# Altium schematic sheet POWER.SchDoc
size A4
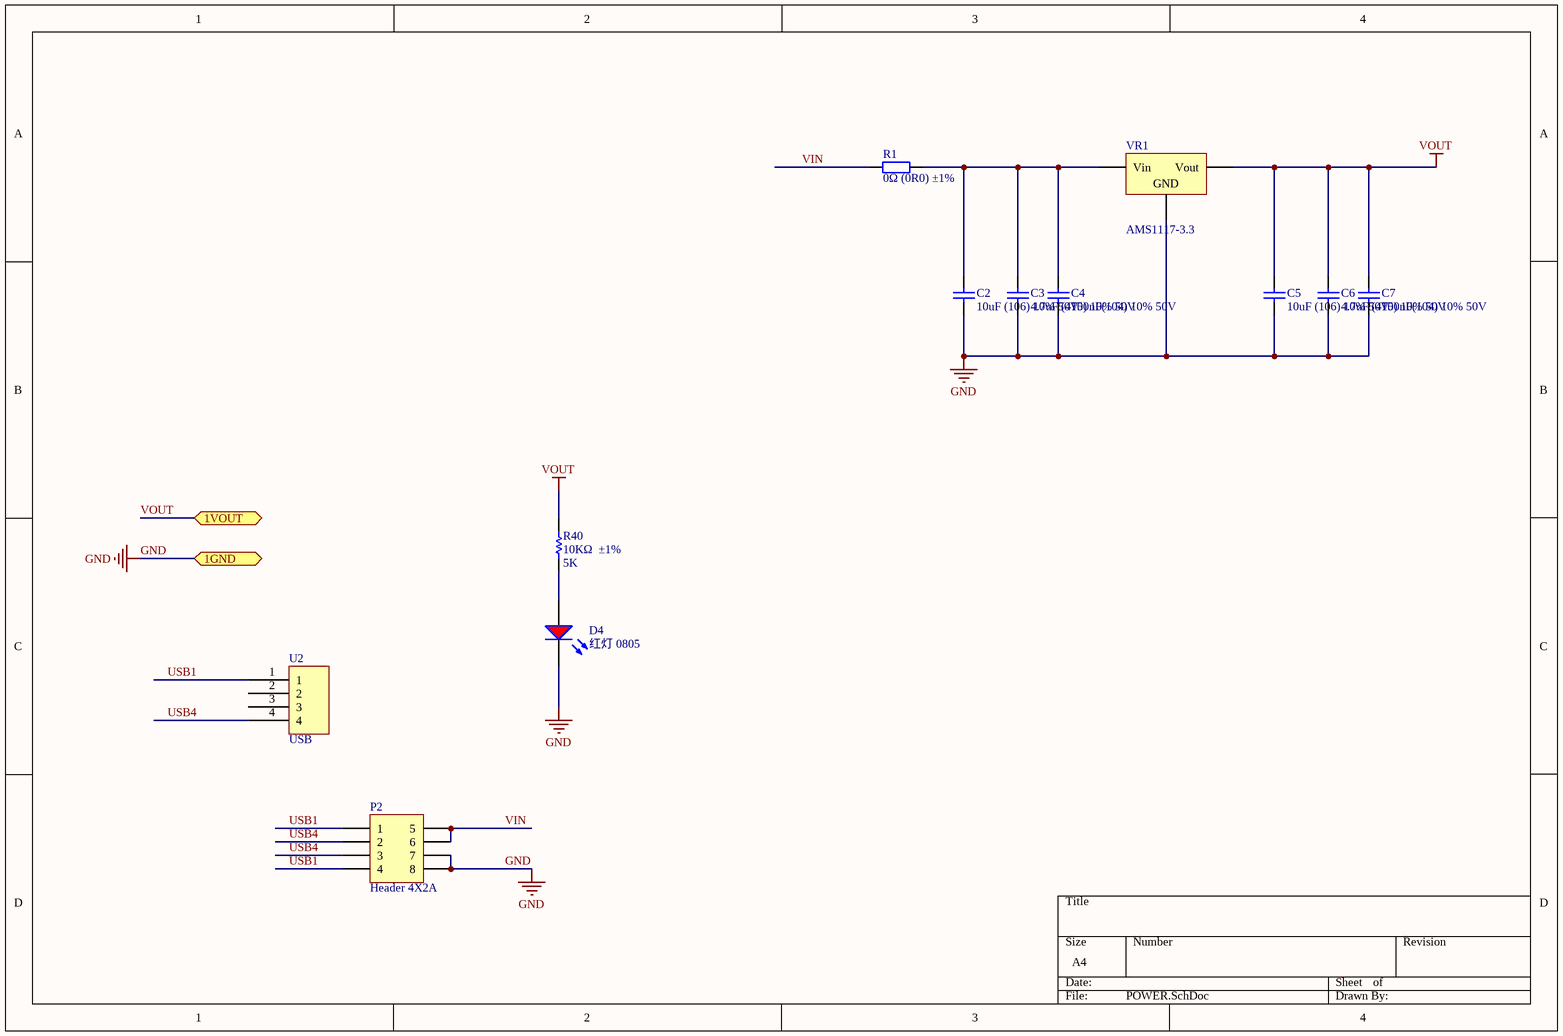
[diagram p0: POWER.SchDoc]

## Parts
C2  10uF (106) 10% 50V  [1206_C]
C3  4.7uF (475) 10% 50V  [1206_C]
C4  100nF(104) 10% 50V  [0805_C]
C5  10uF (106) 10% 50V  [1206_C]
C6  4.7uF (475) 10% 50V  [1206_C]
C7  100nF(104) 10% 50V  [0805_C]
D4  红灯 0805  [0805_LED_S1]
P2  Header 4X2A  [HDR2X4_CEN]
R1  0Ω (0R0) ±1%  [1206_R]
R40  10KΩ  ±1%  value 5K  [0805_R]
U2  USB  [USB_PORT]
VR1  AMS1117-3.3  [SOT-223]

## Ports
1GND, 1VOUT

## Nets
GND: C2.1 C3.1 C4.1 C5.1 C6.1 C7.1 D4.K P2.7 P2.8 VR1.1(GND) ; port 1GND
VOUT: C5.2 C6.2 C7.2 R40.2 VR1.2(Vout) ; port 1VOUT
USB1: P2.1 P2.4 U2.1
USB4: P2.2 P2.3 U2.4
VIN: P2.5 P2.6 R1.1
NetC2_2: C2.2 C3.2 C4.2 R1.2 VR1.3(Vin)
NetD4_A: D4.A R40.1

Not connected (* = marked no-connect by the designer): U2 2 3

## Library data of the parts
C2 C5 = 1206 10uF (106) 10% 50V: 贴片电容; ComponentLink1Description: 供应商链接; ComponentLink1URL: http://www.szlcsc.com/product/details_14236.html; Package: 1206; Supplier: LC; SuppliersPartNumber: C13585
C3 C6 = 1206 4.7uF (475) 10% 50V: 贴片电容; ComponentLink1Description: 供应商链接; ComponentLink1URL: http://www.szlcsc.com/product/details_30577.html; Package: 1206; Supplier: LC; SuppliersPartNumber: C29823
C4 C7 = 0805 100nF(104) 10% 50V: 贴片电容; ComponentLink1Description: 供应商链接; ComponentLink1URL: http://www.szlcsc.com/product/details_50686.html; Package: 0805; Supplier: LC; SuppliersPartNumber: C49678
D4 = 0805 红灯: 发光二极管; ComponentLink1Description: 供应商链接; ComponentLink1URL: http://www.szlcsc.com/product/details_2668.html; Package: 0805; Supplier: LC; SuppliersPartNumber: C2295
P2 = Header 4X2A: Header, 4-Pin, Dual row; LatestRevisionDate: 17-Jul-2002; LatestRevisionNote: Re-released for DXP Platform.; Publisher: Altium Limited
R1 = 1206 0Ω (0R0) 1%: 贴片电阻; ComponentLink1Description: 供应商链接; ComponentLink1URL: http://www.szlcsc.com/product/details_18576.html; Package: 1206; Supplier: LC; SuppliersPartNumber: C17888
R40 = Res1: Resistor; Published: 8-Jun-2000; LatestRevisionDate: 17-Jul-2002; LatestRevisionNote: Re-released for DXP Platform.; PackageReference: AXIAL-0.3; Publisher: Altium Limited; PackageDescription: Axial Device, Thru-Hole; 2 Leads; 0.3 in Pin Spacing
VR1 = SOT-223 AMS1117-3.3: 低压差线性稳压(LDO); ComponentLink1Description: 供应商链接; ComponentLink1URL: http://www.szlcsc.com/product/details_6652.html; Package: SOT-223; Supplier: LC; SuppliersPartNumber: C6186